# Altium schematic sheet USB-UART-interface.SchDoc
size A3; SheetNumber: 13; SheetTotal: 22
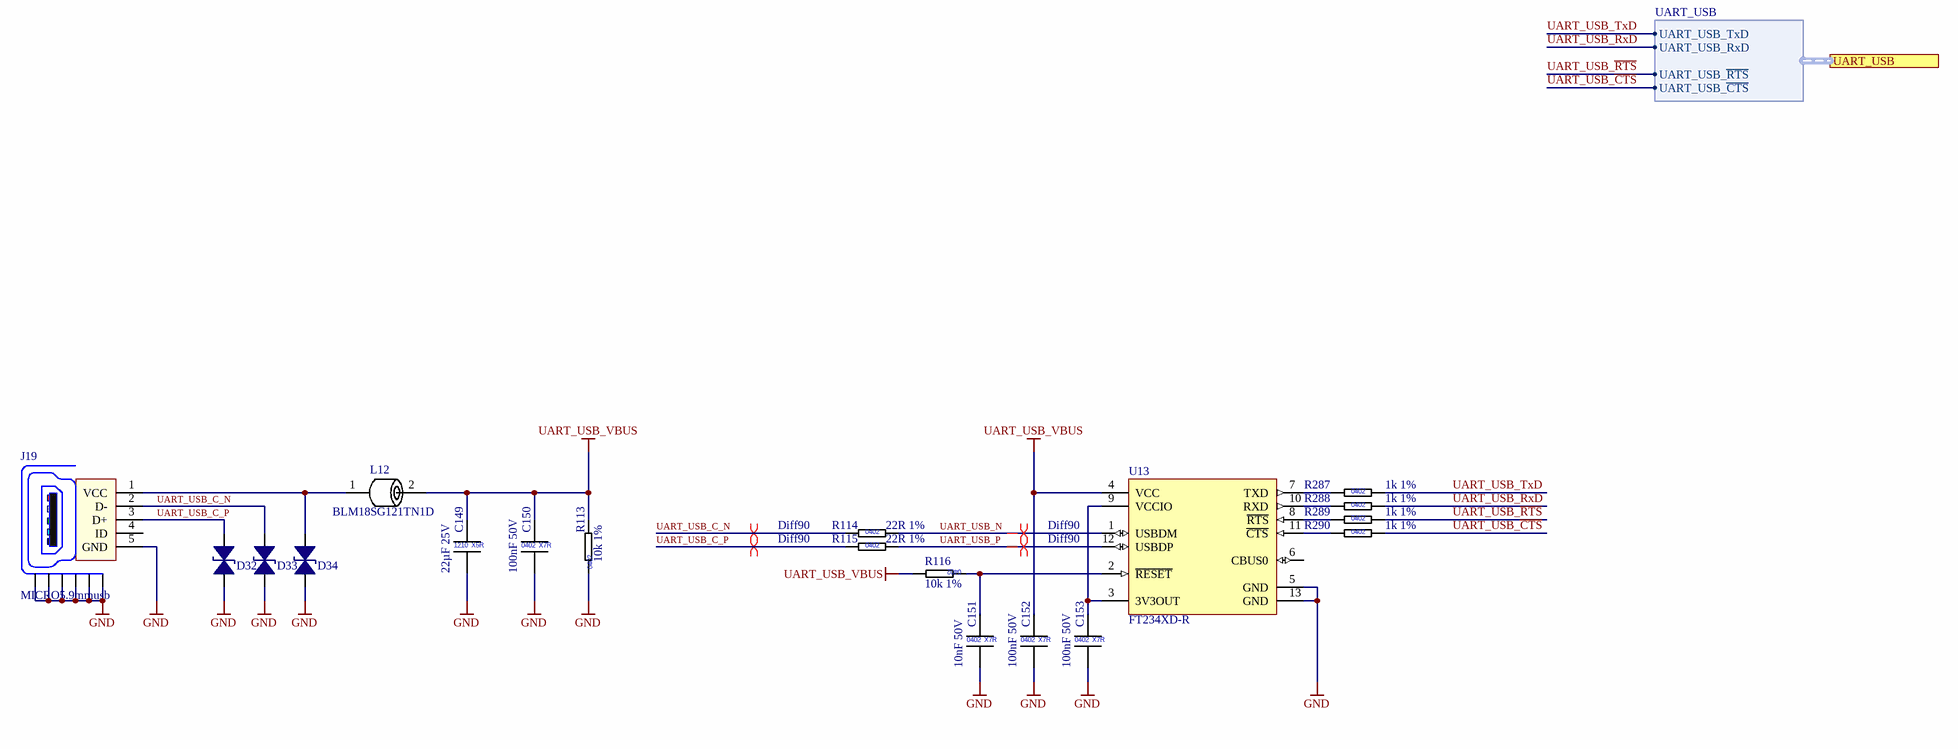
[diagram p0: USB-UART-interface.SchDoc]

## Parts
C149  22µF 25V  [CAP_1210]
C150  100nF 50V  [CAP_0402_L]
C151  10nF 50V  [CAP_0402_L]
C152  100nF 50V  [CAP_0402_L]
C153  100nF 50V  [CAP_0402_L]
D32  CESDP0402UC5VB  [TVS_0402]  (value not drawn)
D33  CESDP0402UC5VB  [TVS_0402]  (value not drawn)
D34  CESDP0402UC5VB  [TVS_0402]  (value not drawn)
J19  MICRO5.9mmusb  [MICRO5.9mmusb]
L12  BLM18SG121TN1D  [L_0603]
R113  10k 1%  [RES_0402_L]
R114  22R 1%  [RES_0402_L]
R115  22R 1%  [RES_0402_L]
R116  10k 1%  [RES_0402_L]
R287  1k 1%  [RES_0402_L]
R288  1k 1%  [RES_0402_L]
R289  1k 1%  [RES_0402_L]
R290  1k 1%  [RES_0402_L]
U13  FT234XD-R  [QFN45P300X300x75_-12N]

## Ports
UART_USB (harness UART_USB, see Top-Level-Sheet[6C], Bank 13_Bank 15_Bank 16[8A])

## Harnesses
UART_USB: UART_USB_TxD, UART_USB_RxD, UART_USB_~{RTS}, UART_USB_~{CTS}

## Nets
GND: C149.2 C150.2 C151.2 C152.2 C153.2 D32.2 D33.2 D34.2 J19.5(GND) J19.6(Shield) J19.7(Shield) J19.8(Shield) J19.9(Shield) J19.10(Shield) J19.11(Shield) R113.1 U13.5(GND) U13.13(GND)
UART_USB_VBUS: C149.1 C150.1 C152.1 L12.2 R113.2 R116.2 U13.4(VCC)
UART_USB_~{CTS}: R290.2 ; port UART_USB.UART_USB_~{CTS}
UART_USB_C_N: D33.1 J19.2(D-) R114.1
UART_USB_C_P: D32.1 J19.3(D+) R115.1
UART_USB_N: R114.2 U13.1(USBDM)
UART_USB_P: R115.2 U13.12(USBDP)
UART_USB_~{RTS}: R289.2 ; port UART_USB.UART_USB_~{RTS}
UART_USB_RxD: R288.2 ; port UART_USB.UART_USB_RxD
UART_USB_TxD: R287.2 ; port UART_USB.UART_USB_TxD
NetC151_1: C151.1 R116.1 U13.2(~{RESET})
NetC153_1: C153.1 U13.3(3V3OUT) U13.9(VCCIO)
NetD34_1: D34.1 J19.1(VCC) L12.1
NetR287_1: R287.1 U13.7(TXD)
NetR288_1: R288.1 U13.10(RXD)
NetR289_1: R289.1 U13.8(~{RTS})
NetR290_1: R290.1 U13.11(~{CTS})

Not connected (* = marked no-connect by the designer): J19 4(ID); U13 6(CBUS0)

## Layout directives
differential pair; net class Diff90: UART_USB_C_N, UART_USB_C_P, UART_USB_N, UART_USB_P

## Notes on the sheet
- Title:
- ++CONFIDENTIAL++
- Date:
- Sheet:
- /
- Time:
- Engineer
- Elektronik- und Softwareentwicklung aus Nürnberg
- The  information  contained  in  these  documents  is  confidential,  privileged  and  only  for  the
  information of the intended recipient and may
  not be used, published or redistributed without
  the prior written consent from PCB Arts GmbH.
- Revision:
- Checked:
- https://pcb-arts.com/
- mail@pcb-arts.com
- (in symbol CAP_0402_10nF_50V) 0402; X7R
- (in symbol CAP_0402_100nF_50V) 0402; X7R
- (in symbol CAP_1210_22µF_25V) 1210; X5R
- (in symbol RES_0402_1k_1%) 0402
- (in symbol RES_0402_10k_1%) 0402
- (in symbol RES_0402_22R_1%) 0402

## Library data of the parts
C149 = CAP_1210_22µF_25V: Multilayer Ceramic Capacitors MLCC - SMD/SMT 1210 25VDC; Manufacturer 1: KEMET; Manufacturer 1 Prt. Nr.: C1210C226K3PACTU; Manufacturer 2 Prt. Nr.: TMK212BBJ226MG-TT; Manufacturer 2: Taiyo Yuden
C150 C152 C153 = CAP_0402_100nF_50V: Multilayer Ceramic Capacitors MLCC - SMD/SMT 0402 50VDC; Manufacturer 1: Murata Electronics; Manufacturer 1 Prt. Nr.: GCM155L8EH104KE07D; Manufacturer 2 Prt. Nr.: UMK105B7104KV-FR; Manufacturer 2: TDK
C151 = CAP_0402_10nF_50V: Multilayer Ceramic Capacitors MLCC - SMD/SMT 0402 50VDC; Manufacturer 1: Wurth Elektronik; Manufacturer 1 Prt. Nr.: 885012205067; Manufacturer 2 Prt. Nr.: AC0402KPX7R9BB103; Manufacturer 2: Yageo
D32-D34 = CESDP0402UC5VB_TVS Diode 0402: Low Capacitance ESD Protection Diode 0402; Manufacturer 1: CREATEK; Manufacturer 2 Prt. Nr.: BPESD0402-05ST; Manufacturer 1 Prt. Nr.: CESDP0402UC5VB; Manufacturer 2: BORN
J19 = SMD micro USB Connector Horizontal C393940: SHOU HAN  MICRO5.9mmusb; Manufacturer 1: SHOU HAN; Manufacturer 1 Prt. Nr.: MICRO5.9mmusb
L12 = BLM18SG121TN1D_Ferrite Beads 0603 120Ohms 3000mA: Ferritperlen BLM18_xN 0603 100MHz 120Ohm 3000mA 25mOhm RSER; Manufacturer 1: Murata Electronics; Manufacturer 1 Prt. Nr.: BLM18SG121TN1D
R113 R116 = RES_0402_10k_1%: Thick Film Resistors - SMD 10kOhm 1%; Manufacturer 1: Vishay / Dale; Manufacturer 1 Prt. Nr.: CRCW040210K0FKEDC; Manufacturer 2 Prt. Nr.: RC0402FR-7W10KL; Manufacturer 2: Yageo
R114 R115 = RES_0402_22R_1%: Thick Film Resistors - SMD 22Ohm 1%; Manufacturer 1: Vishay / Dale; Manufacturer 1 Prt. Nr.: CRCW040222R0FKEDC; Manufacturer 2 Prt. Nr.: RC0402FR-7W22RL; Manufacturer 2: Yageo
R287-R290 = RES_0402_1k_1%: Thick Film Resistors - SMD 1kOhm 1%; Manufacturer 1: Vishay / Dale; Manufacturer 1 Prt. Nr.: CRCW04021K00FKEDC; Manufacturer 2 Prt. Nr.: RC0402FR-7W1KL; Manufacturer 2: Yageo
U13 = FT234XD-R_IC USB SERIAL BASIC UART 12DFN: IC USB SERIAL BASIC UART 12DFN; Manufacturer 1: FTDI; Manufacturer 1 Prt. Nr.: FT234XD-R